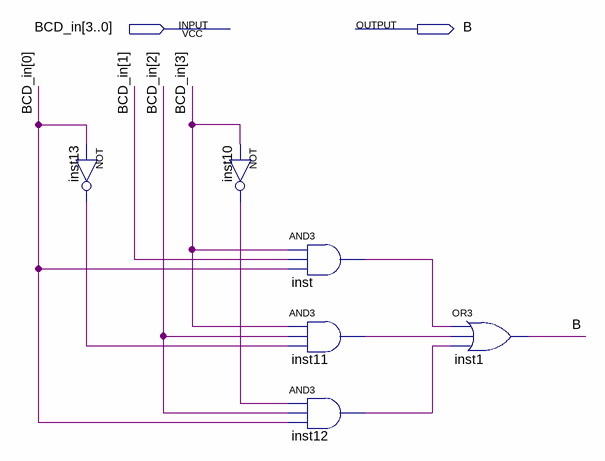
[diagram p0: schematic sheet]
// Quartus schematic B.bdf as structural Verilog: 6 symbols, 2 pins
module B (
  input  [3:0] BCD_in,
  output B
);

  wire inst10_out, inst11_out, inst12_out, inst13_out, inst_out;

  not inst13 (inst13_out, BCD_in[0]);
  not inst10 (inst10_out, BCD_in[3]);
  and inst (inst_out, BCD_in[3], BCD_in[1], BCD_in[0]);
  and inst11 (inst11_out, BCD_in[3], BCD_in[2], inst13_out);
  and inst12 (inst12_out, inst10_out, BCD_in[2], BCD_in[0]);
  or inst1 (B, inst_out, inst11_out, inst12_out);
endmodule
